# Altium schematic sheet Power.SchDoc
size OrCAD C
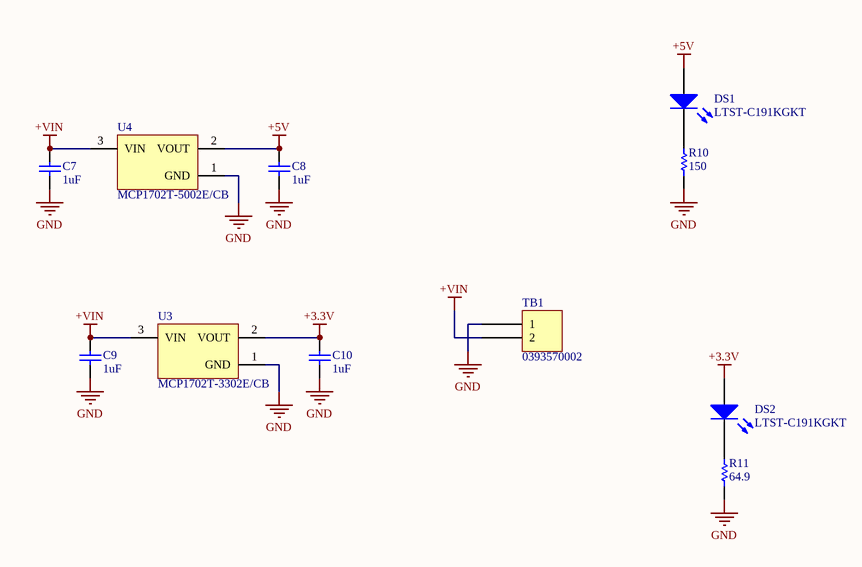
[diagram p0: Power.SchDoc]

## Parts
C7  1uF  [0603]
C8  1uF  [0603]
C9  1uF  [0603]
C10  1uF  [0603]
DS1  LTST-C191KGKT  [LITE-ON-LTST-C191KRKT-2_V]
DS2  LTST-C191KGKT  [LITE-ON-LTST-C191KRKT-2_V]
R10  150  [0402]
R11  64.9  [0402]
TB1  0393570002  [0393570002]
U3  MCP1702T-3302E/CB  [SOT-23A-CB3_N]
U4  MCP1702T-5002E/CB  [SOT-23A-CB3_N]

## Nets
+3.3V: C10.2 DS2.1(A) U3.2(VOUT)
+5V: C8.2 DS1.1(A) U4.2(VOUT)
+VIN: C7.2 C9.2 TB1.2 U3.3(VIN) U4.3(VIN)
GND: C7.1 C8.1 C9.1 C10.1 R10.1 R11.1 TB1.1 U3.1(GND) U4.1(GND)
NetDS1_2: DS1.2(K) R10.2
NetDS2_2: DS2.2(K) R11.2

## Library data of the parts
C7-C10 = C1608X7R1C105K080AC: TDK - C1608X7R1C105K080AC - SMD Multilayer Ceramic Capacitor, 1 µF, 16 V, 0603 [1608 Metric], ± 10%, X7R, C Series TDK; Voltage: 16V; Part Name: C1608X7R1C105K080AC; Supplier 1: Digi-Key; Supplier Part Number 1: 445-1604-1-ND; Manufacturer: TDK; Manufacturer Part Number: C1608X7R1C105K080AC; RoHS: Yes; Category: Ceramic Capacitors; Stock 1: 247756; Pricing 1: 1=0.15000, 10=0.10500, 100=0.04950, 500=0.03472, 1000=0.02875 (USD); Mount: Surface Mount; Case/Package: 0603; Min Operating Temperature: -55°C; Max Operating Temperature: 125°C; Termination: SMD/SMT; Tolerance: 10%; Capacitance: 1uF; Packaging: Tape and Reel; Voltage Rating: 16V; Package Quantity: 1; Voltage Rating (DC): 16V; Length: 1.6mm; Height: 0.8mm; Radiation Hardening: No; REACH SVHC: No SVHC; Weight: 7.1E-05oz; Case Code (Metric): 1608; Case Code (Imperial): 0603; Dielectric Material: Ceramic; Dielectric: X7R; Composition: Ceramic; Depth: 0.8mm; Thickness: 0.037inch; Width: 0.031inch; Lead Free: Lead Free
DS1 DS2 = CMP-2000-05198-1: Chip LED, Green, 574 nm, 40 pF, -55 to 85 degC, 2-Pin SMD, RoHS, Tape and Reel; Manufacturer: Lite-On; Rad Hardened: No; Emitting Color: YellowGreen; Product Height (mm): 0.55mm; Forward Voltage: 2.4V; Number of Elements: 1; Dominant Wave Length: 571nm; DELETED: Compliant; Viewing Angle: 130deg; High Brightness: Yes; Peak Wavelength: 574nm; Type: Uni-Color; Forward Current: 30mA; Product Length (mm): 1.6mm; Luminous Intensity: 35mcd; Test Current (It): 20mA; Chip Material: AlGaInP; Product Depth (mm): 0.8mm; Shape Type: Rectangular; Reverse Voltage: 5V; Power Dissipation: 75W; Pin Count: 2; Lens Dimensions: 1.1X0.8X0.37mm; Packaging: TapeandReel; Main Category: ChipLED; Operating Temperature Classification: Industrial; Package Type: ChipLed; Mounting: SurfaceMount; Lum Intensity: 35mcd; Operating Temp Range: -55Cto85C; Datasheet Version: Jan-07; Datasheet URL: http://download.siliconexpert.com/pdfs/2007/08/26/semi_b/manual/lot/ds/ltst-c191kgkt.pdf; Manufacturer URL: http://www.us.liteon.com/
R10 = CRCW0402150RFKED: Resistor;  Thick Film;  150 Ohms;  0.063 W;  1%;  SMT;  0402;  TCR 37 ppm/DegC; Manufacturer: Vishay; Part Name: CRCW0402150RFKED; Supplier 1: Newark; Supplier Part Number 1: 52K6721; Manufacturer Part Number: CRCW0402150RFKED; RoHS: Yes; Category: Chip SMD Resistors; Stock 1: 40000; Pricing 1: 1=0.10000, 25=0.03700, 100=0.01500, 250=0.01300, 500=0.01000, 1000=0.00700, 2500=0.00600, 5000=0.00400 (USD); Tolerance: 1%; Resistance: 150
R11 = CRCW040264R9FKED: VISHAY   CRCW040264R9FKED.   Surface Mount Chip Resistor, Thick Film, AEC-Q200 CRCW Series, 64.9 ohm, 63 mW,  1%, 50 V; Part Name: CRCW040264R9FKED; Supplier 1: Digi-Key; Supplier Part Number 1: 541-64.9LCT-ND; Manufacturer: Vishay; Manufacturer Part Number: CRCW040264R9FKED; RoHS: Yes; Category: Chip SMD Resistors; Stock 1: 11517; Pricing 1: 1=0.10000, 10=0.03600, 100=0.01460, 1000=0.00657, 2500=0.00570, 5000=0.00471 (USD); Case/Package: 0402; Tolerance: 1%; Resistance: 64.9
TB1 = 0393570002: Conn Eurostyle Block 2 POS 3.5mm Solder ST Thru-Hole 17.5A/Contact Eurostyle™; Manufacturer: Molex; Number of Contacts: 2; Max Voltage Rating (AC): 300V; Wire Gauge (Max): 28AWG; Wire Gauge (Min): 16AWG; Plating: Nickel; Number of Levels: 1; Current: 12A; Part Name: 0393570002; Supplier 1: Digi-Key; Supplier Part Number 1: WM7877-ND; Manufacturer Part Number: 0393570002; RoHS: Yes; Category: Terminal Blocks; Stock 1: 34753; Pricing 1: 1=1.15000, 10=0.71800, 25=0.61400, 50=0.55200, 100=0.54050, 250=0.46000, 500=0.43700, 1000=0.39100, 5000=0.30590 (USD); Mount: Through Hole; Contact Plating: Tin; Contact Material: Copper; Housing Color: Black; Housing Material: Polyamide; Min Operating Temperature: -40°C; Max Operating Temperature: 85°C; Packaging: Bulk; Number of Rows: 1; Termination: Solder; Orientation: Straight; Max Supply Voltage (AC): 300V; Length: 7mm; Pitch: 3.5mm; Depth: 7.29mm; ComponentLink1URL: https://datasheet.ciiva.com/6751/393590004-sd-6751377.pdf?src-supplier=Digi-Key; ComponentLink1Description: https://datasheet.ciiva.com/6751/393590004-sd-6751377.pdf?src-supplier=Digi-Key; Color: Black; Number of Positions Per Level: 2; Voltage: 300V; Radiation Hardening: No
U3 = CMP-0136-00799-1: 250 mA Low Quiescent Current LDO Regulator, 3-Pin SOT-23A, Extended Temperature, Tape and Reel; DatasheetVersion: revD, Jun-2009; PackageVersion: revBB, Aug-2009; PackageReference: SOT-23A-CB3; PackageDescription: 3-Lead Plastic Small Outline Transistor (CB) [SOT-23A]
U4 = CMP-0136-00808-1: 250 mA Low Quiescent Current LDO Regulator, 3-Pin SOT-23A, Extended Temperature, Tape and Reel; PackageDescription: 3-Lead Plastic Small Outline Transistor (CB) [SOT-23A]; PackageReference: SOT-23A-CB3; PackageVersion: revBB, Aug-2009; DatasheetVersion: revD, Jun-2009